# EAGLE design AVR-Megaboard-V1 (EAGLE 6.3)
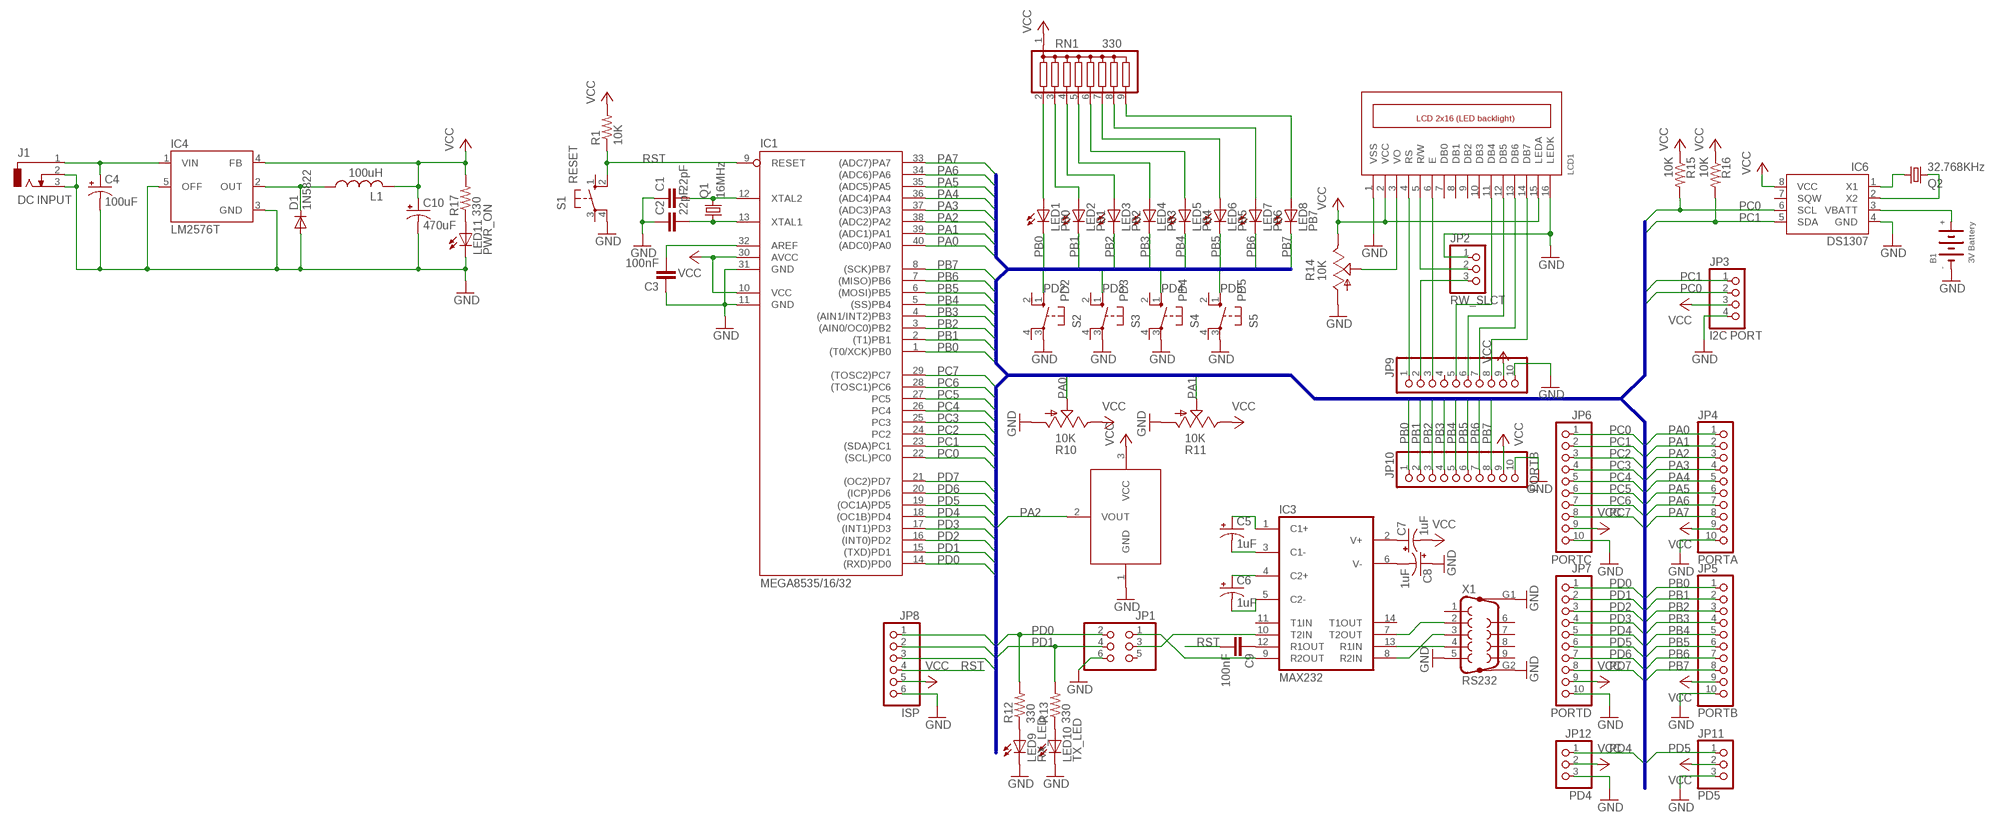
[diagram p0: schematic, sheet 1]

## Parts
B1  3V Battery  BATTERYCR2032  [CR2032]
C1  22pF  C-EU025-024X044  [C025-024X044]
C2  22pF  C-EU025-024X044  [C025-024X044]
C3  100nF  C-EU025-024X044  [C025-024X044]
C4  100uF  CPOL-USE2.5-6  [E2,5-6]
C5  1uF  CPOL-USE2-4  [E2-4]
C6  1uF  CPOL-USE2-4  [E2-4]
C7  1uF  CPOL-USE2-4  [E2-4]
C8  1uF  CPOL-USE2-4  [E2-4]
C9  100nF  C-EU025-024X044  [C025-024X044]
C10  470uF  CPOL-USE3.5-8  [E3,5-8]
D1  1N5822  1N5400  [DO201-15]
IC1  MEGA8535/16/32  MEGA8535-P  [DIL40]
IC2  LM35  [TO92]
IC3  MAX232  [DIL16]
IC4  LM2576T  [TO220-5]
IC6  DS1307  [DIP08]
J1  DC INPUT  DCJ0202  [DCJ0202]
JP1  PINHD-2X3  [2X03]
JP2  RW_SLCT  PINHD-1X3  [1X03]
JP3  I2C PORT  PINHD-1X4  [1X04]
JP4  PORTA  PINHD-1X10  [1X10]
JP5  PORTB  PINHD-1X10  [1X10]
JP6  PORTC  PINHD-1X10  [1X10]
JP7  PORTD  PINHD-1X10  [1X10]
JP8  ISP  PINHD-1X6  [1X06]
JP9  PINHD-1X10  [1X10]
JP10  PORTB  PINHD-1X10  [1X10]
JP11  PD5  PINHD-1X3  [1X03]
JP12  PD4  PINHD-1X3  [1X03]
L1  100uH  L-USTJ3-U2  [TJ3-U2]
LCD1  LCD_2X16  LCD_2X16_SIL  [HY-1602F]
LED1  PB0  LED3MM  [LED3MM]
LED2  PB1  LED3MM  [LED3MM]
LED3  PB2  LED3MM  [LED3MM]
LED4  PB3  LED3MM  [LED3MM]
LED5  PB4  LED3MM  [LED3MM]
LED6  PB5  LED3MM  [LED3MM]
LED7  PB6  LED3MM  [LED3MM]
LED8  PB7  LED3MM  [LED3MM]
LED9  RX_LED  LED3MM  [LED3MM]
LED10  TX_LED  LED3MM  [LED3MM]
LED11  PWR_ON  LED3MM  [LED3MM]
Q1  16MHz  CRYSTALHC49S  [HC49/S]
Q2  32.768KHz  CRYSTALTC26H  [TC26H]
R1  10K  R-US_0207/10  [0207/10]
R10  10K  TRIM_US-CA6V  [CA6V]
R11  10K  TRIM_US-CA6V  [CA6V]
R12  330  R-US_0207/5V  [0207/5V]
R13  330  R-US_0207/5V  [0207/5V]
R14  10K  TRIM_US-CA6V  [CA6V]
R15  10K  R-US_0207/10  [0207/10]
R16  10K  R-US_0207/10  [0207/10]
R17  330  R-US_0207/2V  [0207/2V]
RN1  330  G08R  [SIL9]
S1  RESET  10-XX  [B3F-10XX]
S2  PD2  10-XX  [B3F-10XX]
S3  PD3  10-XX  [B3F-10XX]
S4  PD4  10-XX  [B3F-10XX]
S5  PD5  10-XX  [B3F-10XX]
X1  RS232  F09HP  [F09HP]

## Nets
GND: B1.- C1.1 C2.1 C3.1 C4.- C8.+ C10.- D1.A IC1.11(GND) IC1.31(GND) IC2.1(GND) IC4.3(GND) IC4.5(OFF) IC6.4(GND) J1.2 J1.3 JP1.6 JP2.1 JP3.4 JP4.10 JP5.10 JP6.10 JP7.10 JP8.6 JP9.10 JP10.10 JP11.3 JP12.3 LCD1.1(VSS) LCD1.16(LEDK) LED9.K(C) LED10.K(C) LED11.K(C) R10.A R11.A R14.A S1.4(P1) S2.3(P) S3.3(P) S4.3(P) S5.3(P) X1.5 X1.G1 X1.G2
N$1: C1.2 IC1.12(XTAL2) Q1.2
N$2: C2.2 IC1.13(XTAL1) Q1.1
N$3: C3.2 IC1.32(AREF)
N$4: C4.+ IC4.1(VIN) J1.1
N$5: LED1.A RN1.2
N$6: LED2.A RN1.3
N$7: LED3.A RN1.4
N$8: LED4.A RN1.5
N$9: LED5.A RN1.6
N$10: LED6.A RN1.7
N$11: LED7.A RN1.8
N$12: LED8.A RN1.9
N$13: IC3.13(R1IN) X1.4
N$14: C9.1 IC3.12(R1OUT)
N$15: IC3.10(T2IN) JP1.3
N$16: IC3.9(R2OUT) JP1.1
N$17: C5.- IC3.3(C1-)
N$18: C6.+ IC3.4(C2+)
N$19: C5.+ IC3.1(C1+)
N$20: C6.- IC3.5(C2-)
N$21: C7.+ IC3.2(V+)
N$22: C8.- IC3.6(V-)
N$23: IC3.7(T2OUT) X1.2
N$24: IC3.8(R2IN) X1.3
N$25: LED9.A R12.1
N$26: LED10.A R13.1
N$27: LCD1.3(VO) R14.S
N$28: JP2.2 LCD1.5(R/W)
N$29: IC6.1(X1) Q2.1
N$30: IC6.2(X2) Q2.2
N$31: B1.+ IC6.3(VBATT)
N$32: D1.C IC4.2(OUT) L1.1
N$33: LED11.A R17.1
N$34: JP9.1 LCD1.4(RS)
N$35: JP9.3 LCD1.6(E)
N$36: JP9.5 LCD1.11(DB4)
N$37: JP9.6 LCD1.12(DB5)
N$38: JP9.7 LCD1.13(DB6)
N$39: JP9.8 LCD1.14(DB7)
N$40: JP2.3 JP9.2
PA0: IC1.40((ADC0)PA0) JP4.1 R10.S
PA1: IC1.39((ADC1)PA1) JP4.2 R11.S
PA2: IC1.38((ADC2)PA2) IC2.2(VOUT) JP4.3
PA3: IC1.37((ADC3)PA3) JP4.4
PA4: IC1.36((ADC4)PA4) JP4.5
PA5: IC1.35((ADC5)PA5) JP4.6
PA6: IC1.34((ADC6)PA6) JP4.7
PA7: IC1.33((ADC7)PA7) JP4.8
PB0: IC1.1((T0/XCK)PB0) JP5.1 JP10.1 LED1.K(C)
PB1: IC1.2((T1)PB1) JP5.2 JP10.2 LED2.K(C)
PB2: IC1.3((AIN0/OC0)PB2) JP5.3 JP10.3 LED3.K(C)
PB3: IC1.4((AIN1/INT2)PB3) JP5.4 JP10.4 LED4.K(C)
PB4: IC1.5((SS)PB4) JP5.5 JP10.5 LED5.K(C)
PB5: IC1.6((MOSI)PB5) JP5.6 JP8.1 JP10.6 LED6.K(C)
PB6: IC1.7((MISO)PB6) JP5.7 JP8.2 JP10.7 LED7.K(C)
PB7: IC1.8((SCK)PB7) JP5.8 JP8.3 JP10.8 LED8.K(C)
PC0: IC1.22((SCL)PC0) IC6.6(SCL) JP3.2 JP6.1 R15.2
PC1: IC1.23((SDA)PC1) IC6.5(SDA) JP3.1 JP6.2 R16.2
PC2: IC1.24(PC2) JP6.3
PC3: IC1.25(PC3) JP6.4
PC4: IC1.26(PC4) JP6.5
PC5: IC1.27(PC5) JP6.6
PC6: IC1.28((TOSC1)PC6) JP6.7
PC7: IC1.29((TOSC2)PC7) JP6.8
PD0: IC1.14((RXD)PD0) JP1.2 JP7.1 R12.2
PD1: IC1.15((TXD)PD1) JP1.4 JP7.2 R13.2
PD2: IC1.16((INT0)PD2) JP7.3 S2.1(S)
PD3: IC1.17((INT1)PD3) JP7.4 S3.1(S)
PD4: IC1.18((OC1B)PD4) JP7.5 JP12.1 S4.1(S)
PD5: IC1.19((OC1A)PD5) JP7.6 JP11.1 S5.1(S)
PD6: IC1.20((ICP)PD6) JP7.7
PD7: IC1.21((OC2)PD7) JP7.8
RST: C9.2 IC1.9(RESET) JP8.4 R1.1 S1.2(S1)
VCC: C7.- C10.+ IC1.10(VCC) IC1.30(AVCC) IC2.3(VCC) IC4.4(FB) IC6.8(VCC) JP3.3 JP4.9 JP5.9 JP6.9 JP7.9 JP8.5 JP9.9 JP10.9 JP11.2 JP12.2 L1.2 LCD1.2(VCC) LCD1.15(LEDA) R1.2 R10.E R11.E R14.E R15.1 R16.1 R17.2 RN1.1
Unconnected: IC3.11(T1IN) IC3.14(T1OUT) IC6.7(SQW) JP1.5 JP9.4 LCD1.7(DB0) LCD1.8(DB1) LCD1.9(DB2) LCD1.10(DB3) S1.1(S) S1.3(P) S2.2(S1) S2.4(P1) S3.2(S1) S3.4(P1) S4.2(S1) S4.4(P1) S5.2(S1) S5.4(P1) X1.1 X1.6 X1.7 X1.8 X1.9

## Buses
IO:PA[0..7],PB[0..7],PC[0..7],PD[0..7]

## Power pins joined to a net without a drawn wire
GND: IC3.15(GND)
VCC: IC3.16(VCC)

## Library data of the parts
B1 = microbuilder:BATTERY
C1-C3 C9 = resistor:C-EU: CAPACITOR, European symbol
C4-C8 C10 = resistor:CPOL-US: POLARIZED CAPACITOR, American symbol
D1 = diode:1N5400: DIODE standard rectifier, 3 A, 50 V (Motorola)
IC1 = atmel:MEGA8535-P: MICROCONTROLLER 8 Kbytes FLASH 512 bytes SRAM 512 bytes EEPROM USART 8-channel 10 bit ADC Source: avr.lbr; MPN: ATMEGA8535-16PU; OC_FARNELL: 9171444; OC_NEWARK: 01M6909
IC2 = LM35:LM35
IC3 = maxim:MAX232: RS232 TRANSEIVER; MF: MAXIM; MPN: MAX232ACPE+; OC_FARNELL: 9723773; OC_NEWARK: 68K4544
IC4 = v-reg-3:LM2576: National Semiconductor <http://www.national.com> 3.0A "Simple Switcher"(c) 52kHz, Vout 1.23-37V (HV: 57V), Vin 40V (HV: 60V), 50µA standby current
IC6 = SparkFun:DS1307
J1 = con-jack:DCJ0202: DC POWER JACK Source: DCJ0202.pdf; OC_FARNELL: unknown; OC_NEWARK: unknown
JP1 = pinhead:PINHD-2X3: PIN HEADER
JP2 JP11 JP12 = pinhead:PINHD-1X3: PIN HEADER
JP3 = pinhead:PINHD-1X4: PIN HEADER
JP4-JP7 JP9 JP10 = pinhead:PINHD-1X10: PIN HEADER
JP8 = pinhead:PINHD-1X6: PIN HEADER
L1 = resistor:L-US: INDUCTOR, American symbol
LCD1 = lcd_2x16_led_backlight:LCD_2X16_SIL
LED1-LED11 = led:LED: LED OSRAM: - CHIPLED LG R971, LG N971, LY N971, LG Q971, LY Q971, LO R971, LY R971 LH N974, LH R974 LS Q976, LO Q976, LY Q976 LO Q996 - Hyper CHIPLED LW Q18S LB Q993, LB Q99A, LB R99A - SideLED LS A670, LO A670, LY A670, LG A670, LP A670 LB A673, LV A673, LT A673, LW A673 LH A674 LY A675 LS A676, LA A676, LO A676, LY A676, LW A676 LS A679, LY A679, LG A679 - Hyper Micro SIDELED® LS Y876, LA Y876, LO Y876, LY Y876 LT Y87S - SmartLED LW L88C, LW L88S LB L89C, LB L89S, LG L890 LS L89K, LO L89K, LY L89K LS L896, LA L896, LO L896, LY L896 - TOPLED LS T670, LO T670, LY T670, LG T670, LP T670 LSG T670, LSP T670, LSY T670, LOP T670, LYG T670 LG T671, LOG T671, LSG T671 LB T673, LV T673, LT T673, LW T673 LH T674 LS T676, LA T676, LO T676, LY T676, LB T676, LH T676, LSB T676, LW T676 LB T67C, LV T67C, LT T67C, LS T67K, LO T67K, LY T67K, LW E67C LS E67B, LA E67B, LO E67B, LY E67B, LB E67C, LV E67C, LT E67C LW T67C LS T679, LY T679, LG T679 LS T770, LO T770, LY T770, LG T770, LP T770 LB T773, LV T773, LT T773, LW T773 LH T774 LS E675, LA E675, LY E675, LS T675 LS T776, LA T776, LO T776, LY T776, LB T776 LHGB T686 LT T68C, LB T68C - Hyper Mini TOPLED® LB M676 - Mini TOPLED Santana® LG M470 LS M47K, LO M47K, LY M47K Source: http://www.osram.convergy.de LUXEON: - LUMILED® LXK2-PW12-R00, LXK2-PW12-S00, LXK2-PW14-U00, LXK2-PW14-V00 LXK2-PM12-R00, LXK2-PM12-S00, LXK2-PM14-U00 LXK2-PE12-Q00, LXK2-PE12-R00, LXK2-PE12-S00, LXK2-PE14-T00, LXK2-PE14-U00 LXK2-PB12-K00, LXK2-PB12-L00, LXK2-PB12-M00, LXK2-PB14-N00, LXK2-PB14-P00, LXK2-PB14-Q00 LXK2-PR12-L00, LXK2-PR12-M00, LXK2-PR14-Q00, LXK2-PR14-R00 LXK2-PD12-Q00, LXK2-PD12-R00, LXK2-PD12-S00 LXK2-PH12-R00, LXK2-PH12-S00 LXK2-PL12-P00, LXK2-PL12-Q00, LXK2-PL12-R00 Source: www.luxeon.com KINGBRIGHT: KA-3528ASYC Source: www.kingbright.com
Q1 = crystal:CRYSTAL: CRYSTAL; OC_FARNELL: 1667008; OC_NEWARK: unknown
Q2 = crystal:CRYSTAL: CRYSTAL; OC_FARNELL: unknown; OC_NEWARK: unknown
R1 R12 R13 R15-R17 = resistor:R-US_: RESISTOR, American symbol
R10 R11 R14 = pot:TRIM_US-: POTENTIOMETER
RN1 = resistor-sil:G08R: SIL RESISTOR; OC_FARNELL: unknown; OC_NEWARK: unknown
S1-S5 = switch-omron:10-XX: OMRON SWITCH; MPN: B3F-1000; OC_FARNELL: 176432; OC_NEWARK: 36M3542
X1 = con-subd:F09HP: SUB-D; OC_FARNELL: unknown; OC_NEWARK: unknown

## Board
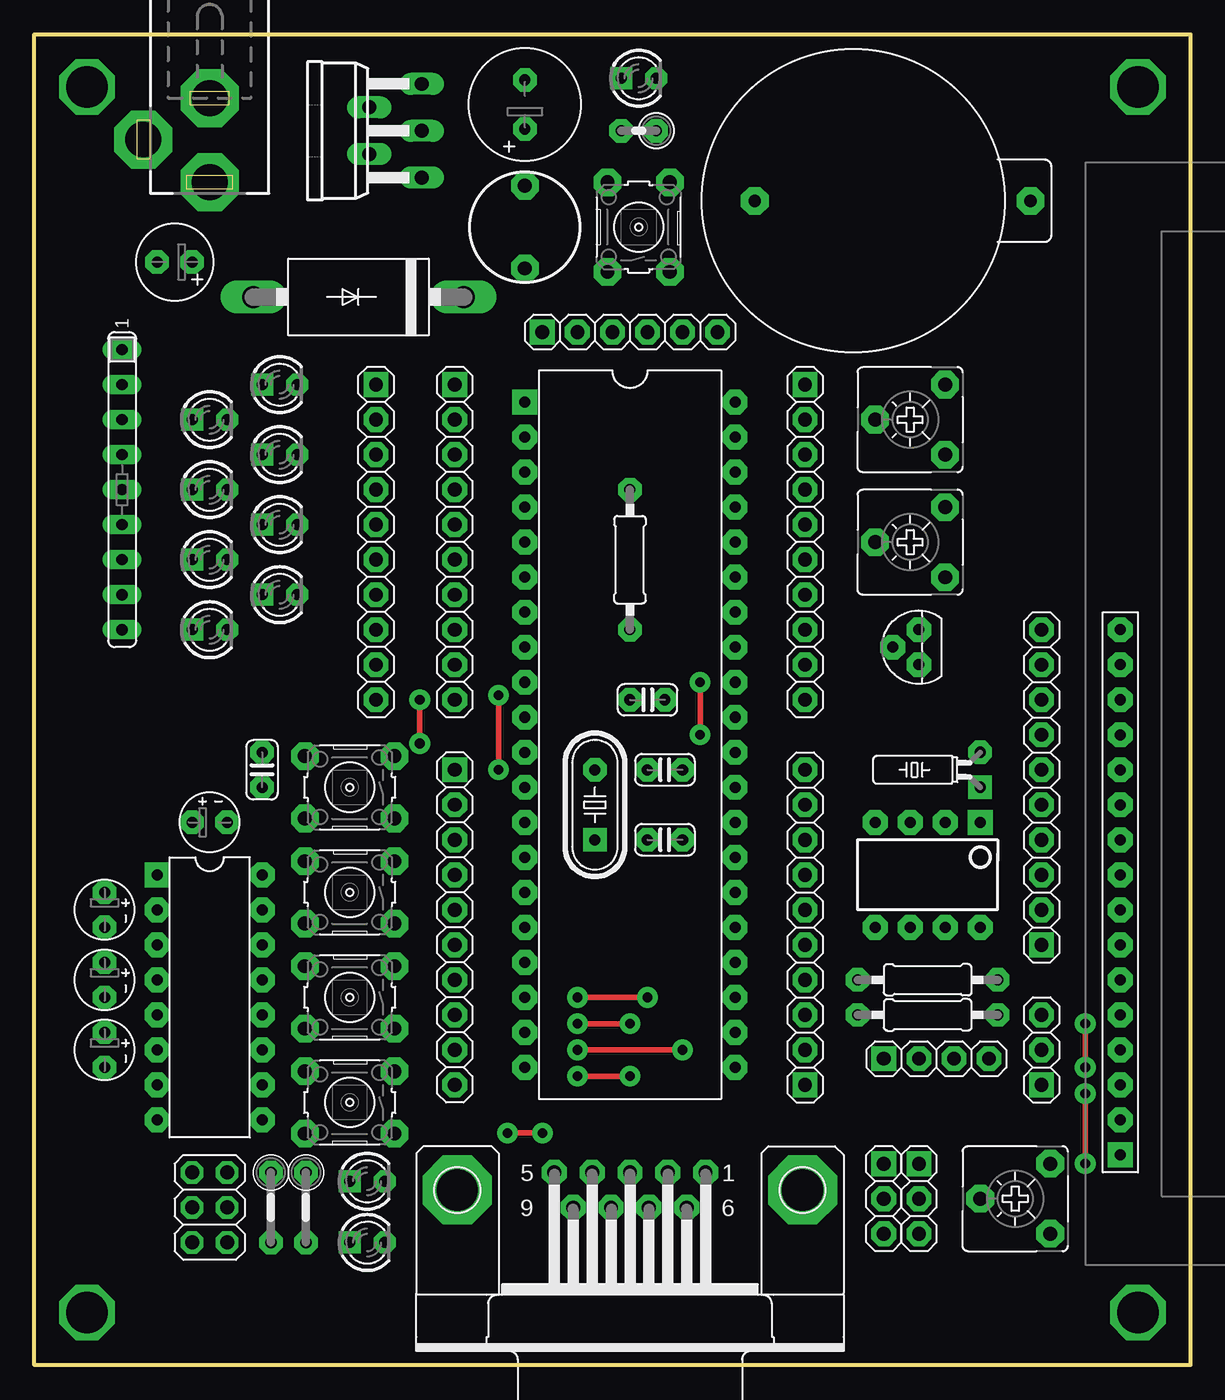
[diagram p1: board, top side]
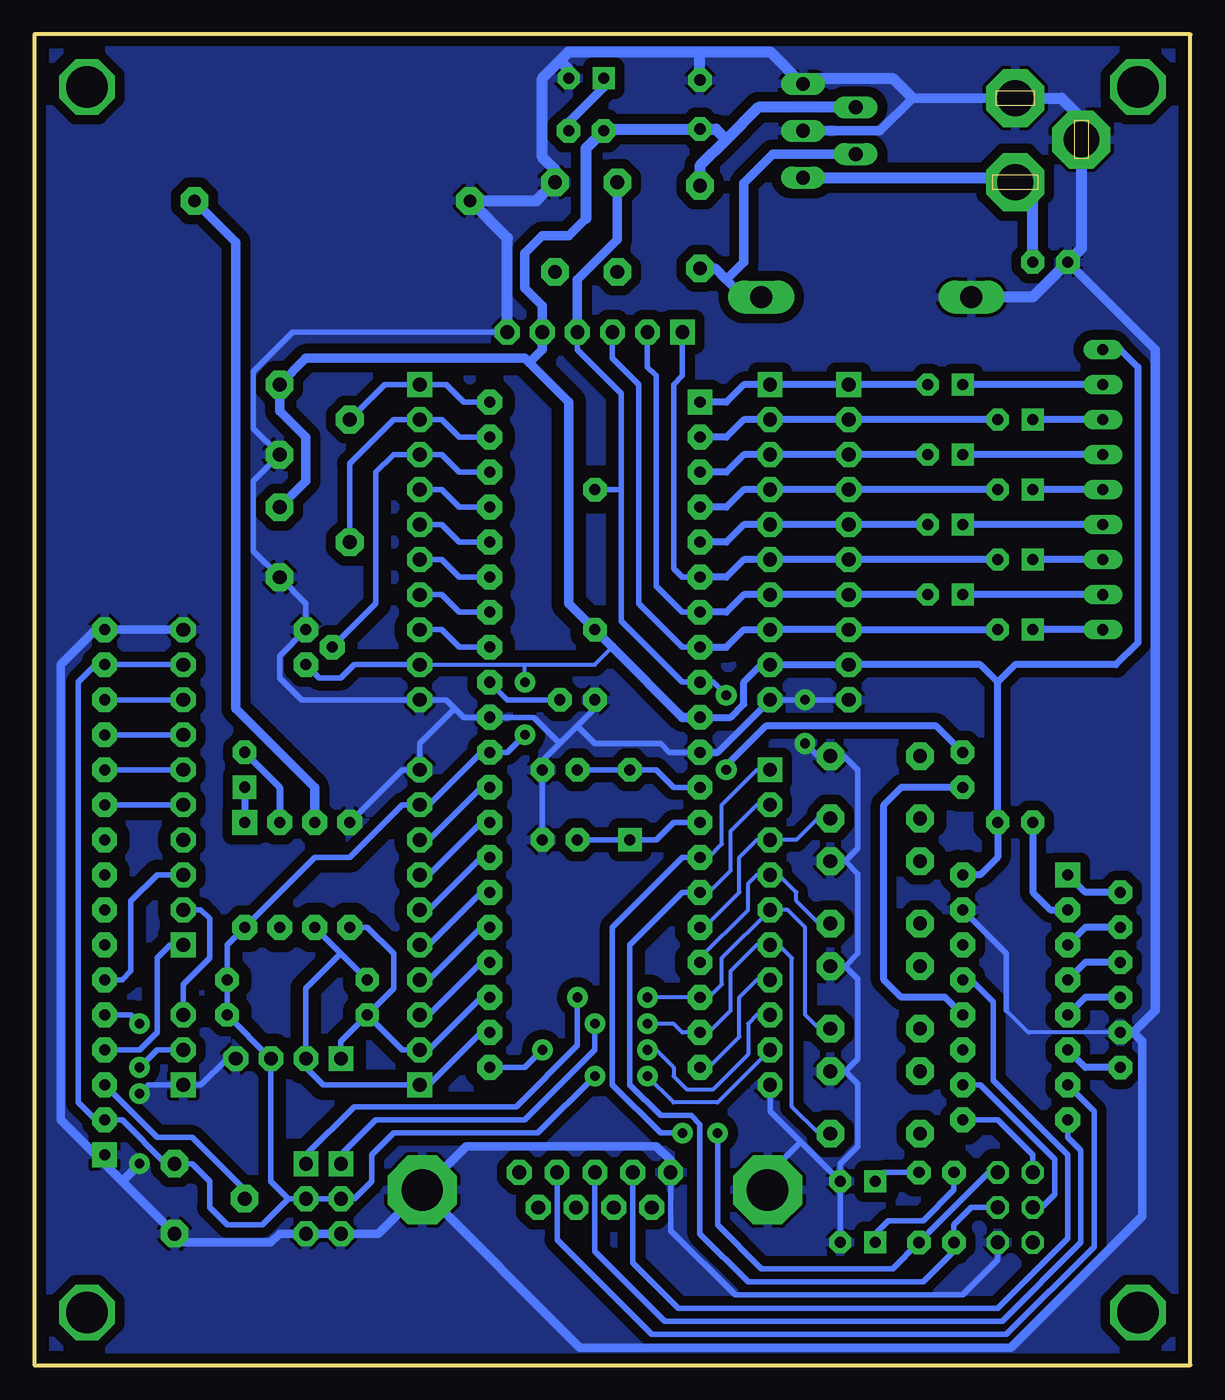
[diagram p2: board, bottom side, seen from below]

Size 83.82 x 96.52 mm. Coordinates in mm from the lower left corner, seen from the top.
Outline: 0,96.52 83.82,96.52 83.82,0 0,0 0,96.52
Copper layers (1*16): Top 0.035mm / dielectric 1.5mm / Bottom 0.035mm
Design rules "default": minimum track width 8mil, minimum drill 20mil, track to track 8mil, track to pad 8mil, pad to pad 8mil, via to via 8mil, smd to smd 8mil, copper to edge 10mil, drill to drill 8mil, minimum pad ring 12mil, minimum via ring 10mil, stop-mask expansion 4mil, vias tented up to drill 25mil, thermal gap 10mil

### Footprints (pad centres in the part's own frame; a part is rotated, then mirrored left to right if it is on the bottom)
CR2032 = drill 0.9 pad 2 octagon: + 10,0; - -10,0
C025-024X044 = drill 0.8 pad 1.7 octagon: 1 -1.27,0; 2 1.27,0
E2,5-6 = drill 0.8 pad 1.7 octagon: + -1.27,0; - 1.27,0
E2-4 = drill 0.8 pad 1.7 octagon: + -1.27,0; - 1.27,0
E3,5-8 = drill 0.813 pad 1.7 octagon: + -1.778,0; - 1.778,0
DO201-15 = drill 1.6 long: A 7.62,0; C -7.62,0
DIL40 = drill 0.8 pad 1.8 square: 1 -24.13,-7.62 | drill 0.8 pad 1.8 octagon: 2 -21.59,-7.62; 3 -19.05,-7.62; 4 -16.51,-7.62; 5 -13.97,-7.62; 6 -11.43,-7.62; 7 -8.89,-7.62; 8 -6.35,-7.62; 9 -3.81,-7.62; 10 -1.27,-7.62; 11 1.27,-7.62; 12 3.81,-7.62; 13 6.35,-7.62; 14 8.89,-7.62; 15 11.43,-7.62; 16 13.97,-7.62; 17 16.51,-7.62; 18 19.05,-7.62; 19 21.59,-7.62; 20 24.13,-7.62; 21 24.13,7.62; 22 21.59,7.62; 23 19.05,7.62; 24 16.51,7.62; 25 13.97,7.62; 26 11.43,7.62; 27 8.89,7.62; 28 6.35,7.62; 29 3.81,7.62; 30 1.27,7.62; 31 -1.27,7.62; 32 -3.81,7.62; 33 -6.35,7.62; 34 -8.89,7.62; 35 -11.43,7.62; 36 -13.97,7.62; 37 -16.51,7.62; 38 -19.05,7.62; 39 -21.59,7.62; 40 -24.13,7.62
TO92 = drill 0.8 pad 1.8 octagon: 1 1.27,0; 2 0,1.905; 3 -1.27,0
DIL16 = drill 0.8 pad 1.8 square: 1 -8.89,-3.81 | drill 0.8 pad 1.8 octagon: 2 -6.35,-3.81; 3 -3.81,-3.81; 4 -1.27,-3.81; 5 1.27,-3.81; 6 3.81,-3.81; 7 6.35,-3.81; 8 8.89,-3.81; 9 8.89,3.81; 10 6.35,3.81; 11 3.81,3.81; 12 1.27,3.81; 13 -1.27,3.81; 14 -3.81,3.81; 15 -6.35,3.81; 16 -8.89,3.81
TO220-5 = drill 1 long: 1 -3.4,-8.4; 2 -1.7,-4.59; 3 0,-8.4; 4 1.7,-4.59; 5 3.4,-8.4
DIP08 = drill 0.8 pad 1.8 square: 1 -3.81,-3.81 | drill 0.8 pad 1.8 octagon: 2 -1.27,-3.81; 3 1.27,-3.81; 4 3.81,-3.81; 5 3.81,3.81; 6 1.27,3.81; 7 -1.27,3.81; 8 -3.81,3.81
DCJ0202 = drill 2.6 pad 4.2 octagon: 1 0,3.1; 2 4.8,0; 3 0,-3
2X03 = drill 1.016 octagon: 1 -2.54,-1.27; 2 -2.54,1.27; 3 0,-1.27; 4 0,1.27; 5 2.54,-1.27; 6 2.54,1.27
1X03 = drill 1 pad 1.8 square: 1 -2.54,0 | drill 1 pad 1.8 octagon: 2 0,0; 3 2.54,0
1X04 = drill 1 pad 1.8 square: 1 -3.81,0 | drill 1 pad 1.8 octagon: 2 -1.27,0; 3 1.27,0; 4 3.81,0
1X10 = drill 1 pad 1.8 square: 1 -11.43,0 | drill 1 pad 1.8 octagon: 2 -8.89,0; 3 -6.35,0; 4 -3.81,0; 5 -1.27,0; 6 1.27,0; 7 3.81,0; 8 6.35,0; 9 8.89,0; 10 11.43,0
1X06 = drill 1 pad 1.8 square: 1 -6.35,0 | drill 1 pad 1.8 octagon: 2 -3.81,0; 3 -1.27,0; 4 1.27,0; 5 3.81,0; 6 6.35,0
TJ3-U2 = drill 1 pad 2 octagon: 1 -3,0; 2 3,0
HY-1602F = drill 0.8 pad 1.8 square: 1 2.54,0 | drill 0.8 pad 1.8 octagon: 2 5.08,0; 3 7.62,0; 4 10.16,0; 5 12.7,0; 6 15.24,0; 7 17.78,0; 8 20.32,0; 9 22.86,0; 10 25.4,0; 11 27.94,0; 12 30.48,0; 13 33.02,0; 14 35.56,0; 15 38.1,0; 16 40.64,0
LED3MM = drill 0.8 pad 1.6 square: A -1.27,0 | drill 0.8 pad 1.6 octagon: K 1.27,0
HC49/S = drill 0.8 pad 1.7 square: 1 -2.54,0 | drill 0.8 pad 1.7 octagon: 2 2.54,0
TC26H = drill 0.813 pad 1.7 square: 1 -1.27,0 | drill 0.813 pad 1.7 octagon: 2 1.27,0
0207/10 = drill 0.8 pad 1.7 octagon: 1 -5.08,0; 2 5.08,0
CA6V = drill 1 pad 2 octagon: A -2.54,-2.54; E 2.54,-2.54; S 0,2.54
0207/5V = drill 0.813 pad 1.7 octagon: 1 -2.54,0; 2 2.54,0
0207/2V = drill 0.813 pad 1.7 octagon: 1 -1.27,0; 2 1.27,0
SIL9 = drill 0.813 long: 1 -10.16,0; 2 -7.62,0; 3 -5.08,0; 4 -2.54,0; 5 0,0; 6 2.54,0; 7 5.08,0; 8 7.62,0; 9 10.16,0
B3F-10XX = drill 1 pad 2 octagon: 1 -3.251,2.261; 2 3.251,2.261; 3 -3.251,-2.261; 4 3.251,-2.261
F09HP = drill 1 pad 1.8 octagon: 1 -5.486,-1.27; 2 -2.743,-1.27; 3 0,-1.27; 4 2.743,-1.27; 5 5.486,-1.27; 6 -4.115,1.27; 7 -1.372,1.27; 8 1.372,1.27; 9 4.115,1.27 | drill 3 pad 5 octagon: G1 -12.522,0; G2 12.522,0

### Placement (x,y rotation side)
B1  62.23,84.45 0 top
C1  45.72,43.18 180 top
C2  45.72,38.1 180 top
C3  44.45,48.26 0 top
C4  10.16,80.01 180 top
C5  5.08,33.02 270 top
C6  5.08,27.94 270 top
C7  12.7,39.37 0 top
C8  5.08,22.86 270 top
C9  16.51,43.18 90 top
C10  35.56,91.44 90 top
D1  23.5,77.47 180 top
IC1  43.18,45.72 270 top
IC2  64.14,52.07 90 top
IC3  12.7,26.67 270 top
IC4  19.68,89.53 90 top
IC6  64.77,35.56 180 top
J1  12.7,88.9 180 top
JP1  12.7,11.43 270 top
JP2  73.03,22.86 90 top
JP3  65.41,22.22 0 top
JP4  55.88,59.69 270 top
JP5  30.48,59.69 270 top
JP6  55.88,31.75 90 top
JP7  30.48,31.75 270 top
JP8  43.18,74.93 0 top
JP9  73.03,41.91 90 top
JP10  24.77,59.69 270 top
JP11  61.59,12.07 270 top
JP12  64.14,12.07 270 top
L1  35.56,82.55 90 top
LCD1  78.74,12.7 90 top
LED1  17.78,71.12 0 top
LED2  12.7,68.58 0 top
LED3  17.78,66.04 0 top
LED4  12.7,63.5 0 top
LED5  17.78,60.96 0 top
LED6  12.7,58.42 0 top
LED7  17.78,55.88 0 top
LED8  12.7,53.34 0 top
LED9  24.13,13.33 0 top
LED10  24.13,8.89 0 top
LED11  43.81,93.34 0 top
Q1  40.64,40.64 90 top
Q2  68.58,43.18 90 top
R1  43.18,58.42 270 top
R10  63.5,68.58 90 top
R11  63.5,59.69 90 top
R12  19.68,11.43 270 top
R13  17.14,11.43 270 top
R14  71.12,12.07 90 top
R15  64.77,27.94 180 top
R16  64.77,25.4 180 top
R17  43.81,89.53 180 top
RN1  6.35,63.5 270 top
S1  43.81,82.55 90 top
S2  22.86,41.91 180 top
S3  22.86,34.29 180 top
S4  22.86,26.67 180 top
S5  22.86,19.05 180 top
X1  43.18,12.7 180 top

### Tracks (layer width: path | path; a pad name or v marks a point on that pad's centre or on a via)
GND  (via drill 0.7 pad 1.5)
  Top 0.4: v76.2,19.68 v76.2,14.61 | v27.94,45.08 v27.94,48.26
  Bottom 0.3: 13.34,25.72 11.75,24.13 C8.+
  Bottom 0.4: C3.1 43.18,47.62 44.45,46.35 | IC1.11 37.78,44.45 38.42,45.08 43.18,45.08 44.45,46.35 | C2.1 C1.1 46.99,43.81 45.72,45.08 | IC6.4 57.15,43.18 JP6.10 55.88,45.08 53.34,47.62 | 13.34,25.72 13.34,29.85 IC3.15 | JP3.4 69.85,22.22 71.75,20.32 JP2.1 75.56,20.32 v76.2,19.68 | 53.34,47.62 52.7,46.99 IC1.31 47.62,46.99 45.72,45.08 | 53.34,47.62 53.98,48.26 JP4.10 64.45,48.26 66.04,49.85 66.04,51.44 IC2.1 64.14,55.24 R11.A 67.94,59.05 67.94,64.13 R10.A 67.94,67.94 67.94,72.07 65.09,74.93 JP8.6 | S3.3 25.04,36.55 | 25.04,36.55 24.13,37.47 24.13,43.18 25.12,44.17 S2.3 27.03,44.17 v27.94,45.08 | S4.3 25.04,28.93 | 25.04,28.93 24.13,29.85 24.13,35.64 25.04,36.55 | S5.3 25.04,21.31 | 25.04,21.31 24.13,22.22 24.13,28.02 25.04,28.93 | LED9.K LED10.K | X1.5 37.69,9.75 33.02,5.08 16.51,5.08 13.97,7.62 JP1.6 | IC4.5 28.16,92.94 | LED9.K 25.4,14.61 24.13,15.88 24.13,20.4 25.04,21.31 | 45.72,45.08 44.45,46.35 | LCD1.16 79.38,53.34 | JP5.10 v27.94,48.26 JP10.10 | JP7.10 30.48,18.42 28.26,16.19 | 28.26,16.19 LED9.K | X1.G2 30.66,13.79 28.26,16.19
  Bottom 0.5: IC1.11 34.29,44.45 JP5.10
  Bottom 0.6: X1.G1 58.88,9.52 JP11.3 JP12.3 66.04,9.52 66.67,8.89 73.03,8.89 R14.A 77.47,13.33 | 79.38,53.34 81.92,50.8 81.92,17.78 79.06,14.92 | JP9.10 LCD1.16 | 4.13,24.13 3.49,23.5 3.49,10.79 13.02,1.27 44.27,1.27 X1.G1 | X1.5 37.69,14.83 38.73,15.88 52.53,15.88 X1.G1 | 77.47,13.33 79.06,14.92 | v76.2,14.61 77.47,13.33 | LCD1.1 79.06,14.92
  Bottom 0.7: J1.3 20.14,91.9 22.51,89.53 IC4.3 | C4.- 2.54,73.66 2.54,25.72 4.13,24.13 C8.+
  Bottom 0.8: J1.3 9.35,91.9 7.9,90.45 J1.2 7.9,81 C4.- 11.43,77.47 D1.A | 20.14,91.9 21.59,93.34 27.3,93.34 27.71,92.94 IC4.5 | 35.56,95.25 45.09,95.25 45.72,94.61 | 35.56,95.25 30.48,95.25 28.16,92.94 | C10.- 35.56,95.25 | 45.72,94.61 46.99,93.34 46.99,87.63 46.08,86.72 S1.4 47.42,84.45 B1.- 49.53,81.75 JP8.6 | LED11.K 45.09,93.98 45.72,94.61
  pour Bottom (isolate 0.7): 0,96.52 83.82,96.52 83.82,0 0,0
N$1
  Bottom 0.4: IC1.12 37.47,41.91 38.73,43.18 Q1.2 C1.2
N$2
  Bottom 0.4: IC1.13 37.47,39.37 38.73,38.1 Q1.1 C2.2
N$3
  Bottom 0.4: C3.2 49.53,48.26 IC1.32
N$4
  Bottom 0.8: C4.+ 11.43,84.53 J1.1 13.04,86.13 IC4.1
N$5
  Bottom 0.5: RN1.2 LED1.A
N$6
  Bottom 0.5: RN1.3 LED2.A
N$7
  Bottom 0.5: RN1.4 LED3.A
N$8
  Bottom 0.5: RN1.5 LED4.A
N$9
  Bottom 0.5: RN1.6 LED5.A
N$10
  Bottom 0.5: RN1.7 LED6.A
N$11
  Bottom 0.5: RN1.8 LED7.A
N$12
  Bottom 0.5: RN1.9 LED8.A
N$13
  Bottom 0.4: X1.4 40.44,7.42 37.15,4.13 13.97,4.13 8.89,9.21 8.89,15.24 14.29,20.64 14.29,26.35 15.88,27.94 IC3.13
N$14
  Bottom 0.5: IC3.12 17.78,26.67 20.95,26.67 22.23,27.94 22.23,40.64 20.95,41.91 C9.1
N$15
  Bottom 0.4: IC3.10 15.24,20.32 9.84,14.92 9.84,12.38 10.79,11.43 JP1.3
N$16
  Bottom 0.4: IC3.9 13.97,17.78 11.43,15.24 JP1.1
N$17
  Bottom 0.5: C5.- 7.62,31.75 IC3.3
N$18
  Bottom 0.5: C6.+ 7.62,29.21 IC3.4
N$19
  Bottom 0.5: C5.+ 7.62,34.29 IC3.1
N$20
  Bottom 0.5: C6.- 7.62,26.67 IC3.5
N$21
  Bottom 0.5: C7.+ 11.43,34.29 10.16,33.02 IC3.2
N$22
  Bottom 0.5: C8.- 7.62,21.59 IC3.6
N$23
  Bottom 0.4: X1.2 45.92,9.09 39.05,2.22 13.34,2.22 6.99,8.57 6.99,18.42 IC3.7
N$24
  Bottom 0.4: X1.3 43.18,8.25 38.1,3.18 13.65,3.18 7.94,8.89 7.94,15.56 8.89,16.51 IC3.8
N$25
  Bottom 0.4: R12.1 22.23,13.97 LED9.A
N$26
  Bottom 0.4: R13.1 17.14,12.7 19.37,10.48 21.91,10.48 22.86,9.52 LED10.A
N$27
  Bottom 0.4: R14.S 68.58,12.7 72.39,16.51 74.93,16.51 LCD1.3
N$28  (via drill 0.7 pad 1.5)
  Top 0.4: v76.2,21.59 v76.2,24.76
  Bottom 0.4: LCD1.5 76.83,25.4 v76.2,24.76 | JP2.2 74.93,22.86 v76.2,21.59
N$29
  Bottom 0.5: Q2.1 IC6.1
N$30
  Bottom 0.5: Q2.2 66.04,41.91 IC6.2
N$31
  Bottom 0.7: IC6.3 63.5,41.91 69.22,47.62 69.22,81.44 B1.+
N$32
  Bottom 0.7: L1.1 34.47,79.55 33.66,78.74 | 33.66,78.74 32.38,77.47 D1.C | IC4.2 30.27,87.83 32.38,85.72 32.38,80.01 33.66,78.74
N$33
  Bottom 0.7: LED11.A 42.55,92.71 45.09,90.17 R17.1
N$34
  Bottom 0.4: LCD1.4 76.2,22.86 74.93,24.13 74.93,29.53 73.98,30.48 JP9.1
N$35
  Bottom 0.4: LCD1.6 77.47,27.94 76.83,28.57 76.83,33.66 74.93,35.56 JP9.3
N$36
  Bottom 0.4: JP9.5 LCD1.11
N$37
  Bottom 0.4: JP9.6 LCD1.12
N$38
  Bottom 0.4: JP9.7 LCD1.13
N$39
  Bottom 0.4: JP9.8 LCD1.14
N$40
  Bottom 0.4: JP2.3 73.03,27.62 71.12,29.53 71.12,32.39 71.75,33.02 JP9.2
N$41
  pour Bottom (isolate 0.9): 0,96.52 83.82,96.52 83.82,0 0,0
N$42  (via drill 3)
  other vias: 3.81,92.71
N$43  (via drill 3)
  other vias: 80.01,92.71
N$44  (via drill 3)
  other vias: 80.01,3.81
N$45  (via drill 3)
  other vias: 3.81,3.81
PA0
  Bottom 0.4: IC1.40 52.7,69.85 53.98,71.12 JP4.1 58.42,71.12 R10.S
PA1
  Bottom 0.4: IC1.39 53.02,67.31 54.29,68.58 JP4.2 57.78,68.58 60.96,65.41 R11.S
PA2
  Bottom 0.4: IC1.38 53.02,64.77 54.29,66.04 JP4.3 57.78,66.04 59.05,64.77 59.05,55.24 IC2.2
PA3
  Bottom 0.4: JP4.4 54.29,63.5 53.02,62.23 IC1.37
PA4
  Bottom 0.4: JP4.5 54.29,60.96 53.02,59.69 IC1.36
PA5
  Bottom 0.4: JP4.6 54.29,58.42 53.02,57.15 IC1.35
PA6
  Bottom 0.4: JP4.7 54.29,55.88 53.02,54.61 IC1.34
PA7
  Bottom 0.4: JP4.8 54.29,53.34 53.02,52.07 IC1.33
PB0
  Bottom 0.5: IC1.1 33.66,69.85 32.38,71.12 JP5.1 JP10.1 LED1.K
PB1
  Bottom 0.5: IC1.2 33.66,67.31 32.38,68.58 JP5.2 JP10.2 LED2.K
PB2
  Bottom 0.5: IC1.3 33.66,64.77 32.38,66.04 JP5.3 JP10.3 LED3.K
PB3
  Bottom 0.5: IC1.4 33.66,62.23 32.38,63.5 JP5.4 JP10.4 LED4.K
PB4
  Bottom 0.5: IC1.5 33.66,59.69 32.38,60.96 JP5.5 JP10.5 LED5.K
PB5
  Bottom 0.4: JP8.1 36.83,71.75 37.47,71.12 37.47,57.78 36.83,57.15 IC1.6
  Bottom 0.5: IC1.6 33.66,57.15 32.38,58.42 JP5.6 JP10.6 LED6.K
PB6
  Bottom 0.4: JP8.2 39.37,72.39 38.73,71.75 38.73,56.52 36.83,54.61 IC1.7
  Bottom 0.5: IC1.7 33.66,54.61 32.38,55.88 JP5.7 JP10.7 LED7.K
PB7
  Bottom 0.4: JP8.3 41.91,73.02 40.01,71.12 40.01,55.24 36.83,52.07 IC1.8
  Bottom 0.5: IC1.8 33.66,52.07 32.38,53.34 JP5.8 JP10.8 LED8.K
PC0
  Bottom 0.4: IC1.22 51.44,24.13 55.24,20.32 JP6.1 62.87,20.32 64.14,21.59 JP3.2 64.14,27.31 61.59,29.85 | IC6.6 61.59,29.85 | 61.59,29.85 R15.2
PC1
  Bottom 0.4: IC1.23 51.44,26.67 55.24,22.86 JP6.2 57.15,22.86 R16.2 | JP3.1 61.59,23.5 R16.2 | R16.2 57.78,27.31 57.78,29.85 59.69,31.75 IC6.5
PC2
  Bottom 0.4: IC1.24 51.44,29.21 55.24,25.4 JP6.3
PC3
  Bottom 0.4: IC1.25 51.44,31.75 55.24,27.94 JP6.4
PC4
  Bottom 0.4: IC1.26 51.44,34.29 55.24,30.48 JP6.5
PC5
  Bottom 0.4: IC1.27 51.44,36.83 55.24,33.02 JP6.6
PC6
  Bottom 0.4: IC1.28 51.44,39.37 55.24,35.56 JP6.7
PC7
  Bottom 0.4: IC1.29 51.44,41.91 55.24,38.1 JP6.8
PD0  (via drill 0.7 pad 1.5)
  Top 0.4: v34.29,16.83 v36.83,16.83
  Bottom 0.3: IC1.14 34.92,36.83 33.97,37.78 33.97,40.64 31.43,43.18 JP7.1
  Bottom 0.4: IC1.14 36.83,36.83 41.91,31.75 41.91,20.32 38.42,16.83 v36.83,16.83 | JP1.2 14.61,13.97 R12.2 21.59,6.98 31.11,6.98 34.29,10.16 v34.29,16.83
PD1
  Bottom 0.3: IC1.15 34.92,34.29 33.34,35.88 33.34,38.73 31.43,40.64 JP7.2
  Bottom 0.4: IC1.15 36.83,34.29 40.64,30.48 40.64,20.32 38.42,18.1 36.2,18.1 35.56,17.46 35.56,9.52 32.07,6.03 19.37,6.03 17.14,8.25 R13.2 17.14,10.16 15.88,11.43 JP1.4
PD2
  Bottom 0.3: IC1.16 35.24,31.75 32.7,34.29 32.7,36.83 31.43,38.1 JP7.3 28.57,38.1 27.03,39.65 S2.1
PD3
  Bottom 0.3: IC1.17 35.56,29.53 32.07,33.02 32.07,34.92 31.43,35.56 JP7.4 29.84,35.56 28.57,34.29 28.57,33.66 26.95,32.03 S3.1
PD4  (via drill 0.7 pad 1.5)
  Top 0.4: v39.37,26.67 v44.45,26.67
  Bottom 0.3: S4.1 26.95,24.41 27.94,25.4 27.94,31.75 29.21,33.02 JP7.5 33.97,29.53 33.97,27.62 34.92,26.67 IC1.18 v39.37,26.67
  Bottom 0.4: v44.45,26.67 44.45,23.18 48.9,18.73 60.64,18.73 64.14,15.24 JP12.1
PD5  (via drill 0.7 pad 1.5)
  Top 0.4: v39.37,24.76 v43.18,24.76
  Bottom 0.3: S5.1 26.95,16.79 28.89,18.73 28.89,29.53 29.84,30.48 JP7.6 31.43,30.48 33.34,28.57 33.34,25.72 34.92,24.13 IC1.19 36.83,24.13 37.47,24.76 v39.37,24.76
  Bottom 0.4: v43.18,24.76 43.18,22.86 48.26,17.78 59.05,17.78 61.59,15.24 JP11.1
PD6
  Bottom 0.3: IC1.20 34.92,21.59 32.7,23.81 32.7,26.67 31.43,27.94 JP7.7
PD7  (via drill 0.7 pad 1.5)
  Top 0.4: v39.37,22.86 v46.99,22.86
  Bottom 0.3: JP7.8 31.43,25.4 32.07,24.76 32.07,22.54 34.61,20 36.51,20 37.47,20.96 37.47,21.59 38.73,22.86 v39.37,22.86
  Bottom 0.4: IC1.21 48.26,21.59 v46.99,22.86
RST  (via drill 0.7 pad 1.5)
  Top 0.4: v33.66,43.18 v33.66,48.58
  Bottom 0.4: JP8.4 44.45,73.66 41.27,70.48 41.27,63.5 | 41.27,63.5 41.27,53.97 36.83,49.53 IC1.9 34.61,49.53 v33.66,48.58 | R1.1 41.27,63.5 | 33.66,43.5 v33.66,43.18
  Bottom 0.5: C9.2 18.41,46.35 30.8,46.35 33.66,43.5
  Bottom 0.7: S1.2 41.55,81.64 44.45,78.74 JP8.4
VCC  (via drill 0.7 pad 1.5)
  Top 0.4: v43.18,20.96 v39.37,20.96 | v48.26,45.72 v48.26,49.53
  Bottom 0.3: JP4.9 48.26,50.8 | 48.26,50.8 43.18,50.8 41.91,52.07 | JP7.9 34.29,19.05 37.47,19.05 v39.37,20.96 | v48.26,49.53 48.26,50.8
  Bottom 0.4: 65.41,12.07 67.31,10.16 69.85,10.16 71.12,11.43 71.12,13.33 72.39,14.61 R14.E 74.3,14.61 77.47,17.78 LCD1.2 79.38,17.78 80.64,19.05 80.64,49.53 79.38,50.8 LCD1.15 JP9.9 | 65.41,12.07 JP12.2 JP11.2 60.64,12.07 59.37,13.33 59.37,15.24 57.78,16.83 47.31,16.83 v43.18,20.96 | 65.41,12.07 66.67,13.33 JP3.3 R16.1 R15.1 69.85,30.48 IC6.8 63.5,36.83 60.96,36.83 57.15,40.64 JP6.9 55.24,40.64 51.44,44.45 IC1.30 49.53,44.45 v48.26,45.72 | IC2.3 63.18,49.85 61.59,49.85 60.64,50.8 JP4.9 | R17.2 42.42,89.66
  Bottom 0.5: IC1.10 33.34,46.99 32.38,47.94 32.38,49.53 31.11,50.8 JP5.9 JP10.9 15.24,50.8 13.97,49.53 | IC3.16 15.24,35.56 13.97,36.83 C7.- 13.97,49.53 | RN1.1 5.08,73.66 3.81,72.39 3.81,52.39 5.4,50.8 12.7,50.8 13.97,49.53
  Bottom 0.7: R11.E 64.14,64.13 64.14,67.31 66.04,69.22 R10.E 64.14,73.02 48.26,73.02 47.94,72.71 | IC1.10 36.83,46.99 41.91,52.07 R1.2 45.09,55.24 45.09,69.85 47.94,72.71 | 43.81,83.19 45.09,81.91 46.99,81.91 48.26,80.64 48.26,78.1 46.99,76.83 JP8.5 46.99,73.66 47.94,72.71
  Bottom 0.8: IC4.4 31.32,91.23 33.66,88.9 | 33.66,88.9 35.56,86.99 L1.2 | 42.42,89.66 C10.+ 34.42,89.66 33.66,88.9 | 43.81,83.19 43.81,88.27 R17.2

### Text on the board
tValues: AVR Megaboard V1 | 0 | ADC0 | 0 | ADC1 | ADC3 | 7 | 7 | VCC | GND | GND | VCC | 0 | 7 | LCD_PORT | 7 | 0 | SDA | SCL | VCC | GND | VCC | GND | RX | TX | GND | LCD | RX_LED | CONTRAST | TX_LED